# Altium schematic sheet main.SchDoc: BICYCLE_PROJECT
size A4; SheetNumber: 1; SheetTotal: 5
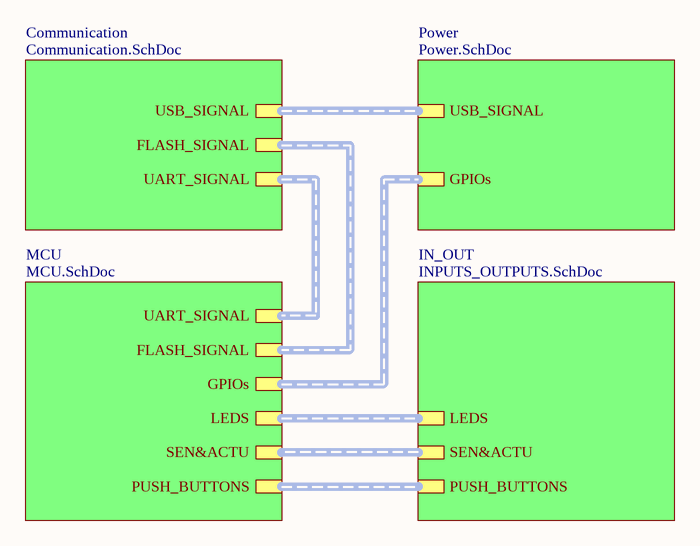
[diagram p0: main.SchDoc]

## Sub-sheets
Communication = Communication.SchDoc: USB_SIGNAL (harness USB_SIGNAL), UART_SIGNAL (harness UART_SIGNAL), FLASH_SIGNAL (harness FLASH_SIGNAL)
IN_OUT = INPUTS_OUTPUTS.SchDoc: LEDS (harness LEDS), PUSH_BUTTONS (harness PUSH_BUTTONS), SEN&ACTU (harness SENSORS&ACTUATORS)
MCU = MCU.SchDoc: UART_SIGNAL (harness UART_SIGNAL), LEDS (harness LEDS), PUSH_BUTTONS (harness PUSH_BUTTONS), FLASH_SIGNAL (harness FLASH_SIGNAL), SEN&ACTU (harness SENSORS&ACTUATORS), GPIOs (harness GPIOs)
Power = Power.SchDoc: USB_SIGNAL (harness USB_SIGNAL), GPIOs (harness GPIOs)

## Buses and harness runs
harness sheet Communication/FLASH_SIGNAL = sheet MCU/FLASH_SIGNAL
harness sheet Communication/UART_SIGNAL = sheet MCU/UART_SIGNAL
harness sheet Communication/USB_SIGNAL = sheet Power/USB_SIGNAL
harness sheet IN_OUT/LEDS = sheet MCU/LEDS
harness sheet IN_OUT/PUSH_BUTTONS = sheet MCU/PUSH_BUTTONS
harness sheet IN_OUT/SEN&ACTU = sheet MCU/SEN&ACTU
harness sheet MCU/GPIOs = sheet Power/GPIOs